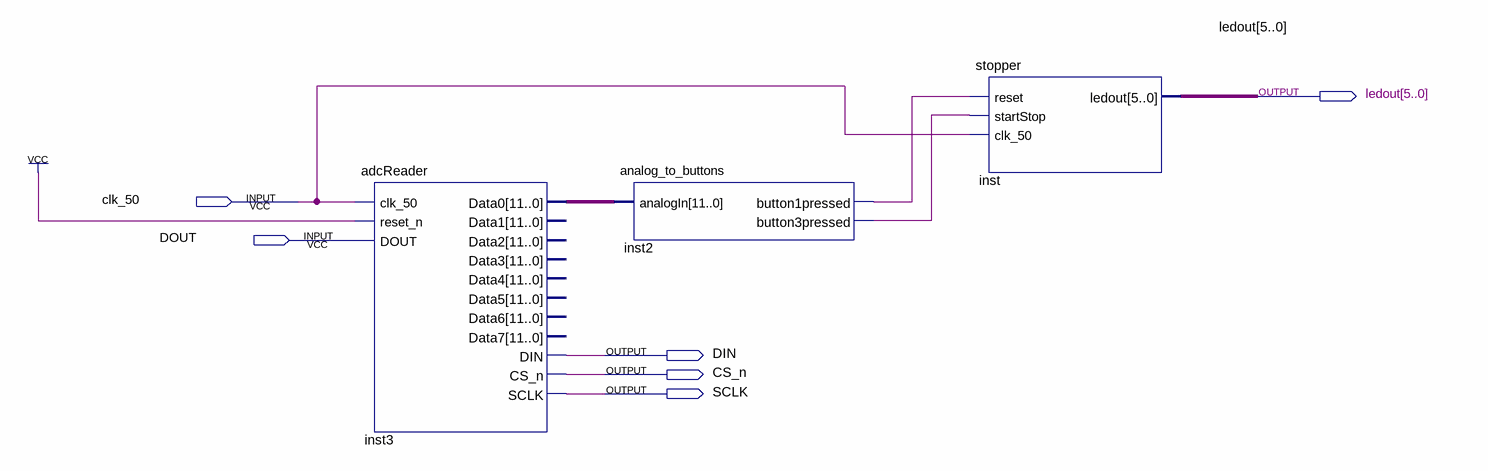
[diagram p0: schematic sheet]
// Quartus schematic stoppuhr.bdf as structural Verilog: 3 symbols, 6 pins
module stoppuhr (
  input  clk_50,
  input  DOUT,
  output [5:0] ledout,
  output DIN,
  output CS_n,
  output SCLK
);

  wire inst2_button1pressed, inst2_button3pressed;
  wire [11:0] inst3_data0;

  adcReader inst3 (
    .clk_50(clk_50), .reset_n(1'b1), .DOUT(DOUT), .Data0(inst3_data0), .DIN(DIN), .CS_n(CS_n), .SCLK(SCLK));  // open: Data1, Data2, Data3, Data4, Data5, Data6, Data7
  analog_to_buttons inst2 (
    .analogIn(inst3_data0), .button1pressed(inst2_button1pressed), .button3pressed(inst2_button3pressed));
  stopper inst (.reset(inst2_button1pressed), .startStop(inst2_button3pressed), .clk_50(clk_50), .ledout(ledout));
endmodule
